# EAGLE design mmimplant (EAGLE 9.6.2)
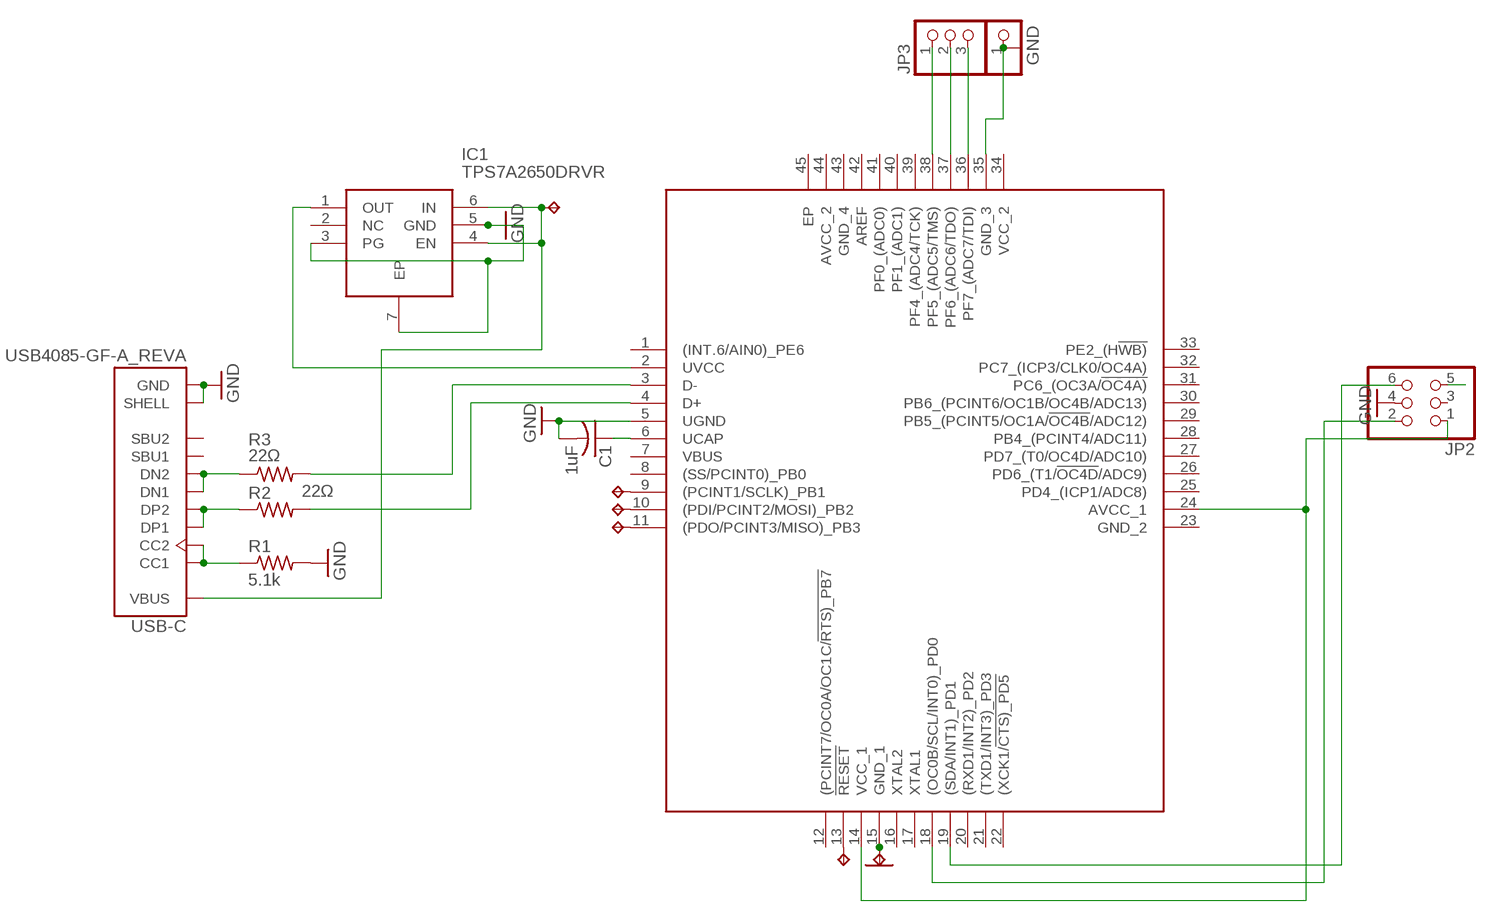
[diagram p0: schematic, sheet 1]

## Parts
5V  TPTP17R  [TP17R]
C1  1uF  C-USC0805  [C0805]
GND  TPTP17R  [TP17R]
IC1  TPS7A2650DRVR  [SON65P200X200X80-7N]
IC2  ATMEGA32U4-MU  [QFN50P700X700X100-45N]
JP1  PINHD-1X1  [1X01]
JP2  PINHD-2X3  [2X03]
JP3  PINHD-1X3  [1X03]
MISO  TPTP17R  [TP17R]
MOSI  TPTP17R  [TP17R]
R1  5.1k  R-US_R0603  [R0603]
R2  22Ω  R-US_R0805  [R0805]
R3  22Ω  R-US_R0805  [R0805]
RST  TPTP17R  [TP17R]
SCLK  TPTP17R  [TP17R]
USB-C  USB4085-GF-A_REVA  [GCT_USB4085-GF-A_REVA]

## Nets
5V: IC1.1(OUT) IC2.2(UVCC)
CAPS: IC2.38(PF5_(ADC5/TMS)) JP3.1
CC: R1.1 USB-C.A5(CC1) USB-C.B5(CC2)
CLK: IC2.19((SDA/INT1)_PD1) JP2.6
D+: R2.1 USB-C.A6(DP1) USB-C.B6(DP2)
D+RES: IC2.4(D+) R2.2
D-: R3.1 USB-C.A7(DN1) USB-C.B7(DN2)
D-RES: IC2.3(D-) R3.2
DATA: IC2.18((OC0B/SCL/INT0)_PD0) JP2.2
GND: C1.2 GND.TP IC1.3(PG) IC1.5(GND) IC1.7(EP) IC2.5(UGND) IC2.15(GND_1) IC2.35(GND_3) JP1.1 JP2.4 R1.2 USB-C.A1(GND) USB-C.A12(GND) USB-C.B1(GND) USB-C.B12(GND) USB-C.P1(SHELL) USB-C.P2(SHELL) USB-C.P3(SHELL) USB-C.P4(SHELL)
MISO: IC2.11((PDO/PCINT3/MISO)_PB3) MISO.TP
MOSI: IC2.10((PDI/PCINT2/MOSI)_PB2) MOSI.TP
NUM: IC2.37(PF6_(ADC6/TDO)) JP3.2
PE: JP2.5
RST: IC2.13(!RESET) RST.TP
SCLK: IC2.9((PCINT1/SCLK)_PB1) SCLK.TP
SCROLL: IC2.36(PF7_(ADC7/TDI)) JP3.3
UCAP: C1.1 IC2.6(UCAP)
VCC1: IC2.14(VCC_1) IC2.24(AVCC_1) JP2.1
VIN: 5V.TP IC1.4(EN) IC1.6(IN) USB-C.A4(VBUS) USB-C.A9(VBUS) USB-C.B4(VBUS) USB-C.B9(VBUS)
Unconnected: IC1.2(NC) IC2.1((INT.6/AIN0)_PE6) IC2.7(VBUS) IC2.8((SS/PCINT0)_PB0) IC2.12((PCINT7/OC0A/OC1C/!RTS)_PB7) IC2.16(XTAL2) IC2.17(XTAL1) IC2.20((RXD1/INT2)_PD2) IC2.21((TXD1/INT3)_PD3) IC2.22((XCK1/!CTS)_PD5) IC2.23(GND_2) IC2.25(PD4_(ICP1/ADC8)) IC2.26(PD6_(T1/!OC4D!/ADC9)) IC2.27(PD7_(T0/OC4D/ADC10)) IC2.28(PB4_(PCINT4/ADC11)) IC2.29(PB5_(PCINT5/OC1A/!OC4B!/ADC12)) IC2.30(PB6_(PCINT6/OC1B/OC4B/ADC13)) IC2.31(PC6_(OC3A/!OC4A)) IC2.32(PC7_(ICP3/CLK0/OC4A)) IC2.33(PE2_(H!WB)) IC2.34(VCC_2) IC2.39(PF4_(ADC4/TCK)) IC2.40(PF1_(ADC1)) IC2.41(PF0_(ADC0)) IC2.42(AREF) IC2.43(GND_4) IC2.44(AVCC_2) IC2.45(EP) JP2.3 USB-C.A8(SBU1) USB-C.B8(SBU2)

## Library data of the parts
5V GND MISO MOSI RST SCLK = testpad:TP: Test pad
C1 = adafruit:C-US: CAPACITOR, American symbol
IC1 = SamacSys_Parts:TPS7A2650DRVR: LDO Voltage Regulators 500-mA 18-V ultra-low-IQ low-dropout (LDO) linear voltage regulator with power good 6-WSON -40 to 125 Source: Datasheet <https://www.ti.com/lit/gpn/TPS7A26>; DESCRIPTION: LDO Voltage Regulators 500-mA 18-V ultra-low-IQ low-dropout (LDO) linear voltage regulator with power good 6-WSON -40 to 125; HEIGHT: 0.8mm; MANUFACTURER_NAME: Texas Instruments; MANUFACTURER_PART_NUMBER: TPS7A2650DRVR; MOUSER_PART_NUMBER: 595-TPS7A2650DRVR; MOUSER_PRICE-STOCK: https://www.mouser.co.uk/ProductDetail/Texas-Instruments/TPS7A2650DRVR?qs=OTrKUuiFdkaeaXj%2F%252BB59oA%3D%3D
IC2 = SamacSys_Parts:ATMEGA32U4-MU: MCU 8-bit ATmega AVR RISC 32KB Flash Atmel ATMEGA32U4-MU, 8bit AVR Microcontroller, 16MHz, 32 kB Flash, 44-Pin QFN Source: Datasheet <https://componentsearchengine.com/Datasheets/2/ATMEGA32U4-MU.pdf>; DESCRIPTION: MCU 8-bit ATmega AVR RISC 32KB Flash Atmel ATMEGA32U4-MU, 8bit AVR Microcontroller, 16MHz, 32 kB Flash, 44-Pin QFN; HEIGHT: 1mm; MANUFACTURER_NAME: Microchip; MANUFACTURER_PART_NUMBER: ATMEGA32U4-MU; MOUSER_PART_NUMBER: 556-ATMEGA32U4-MU; MOUSER_PRICE-STOCK: https://www.mouser.co.uk/ProductDetail/Microchip-Technology-Atmel/ATMEGA32U4-MU?qs=JV7lzlMm3yJYRpi0cY3cKw%3D%3D
JP1 = pinhead:PINHD-1X1: PIN HEADER
JP2 = pinhead:PINHD-2X3: PIN HEADER
JP3 = adafruit:PINHD-1X3: PIN HEADER
R1-R3 = adafruit:R-US_: RESISTOR, American symbol
USB-C = USB4085-GF-A_REVA:USB4085-GF-A_REVA: USB 2.0 Type C Receptacle Dip Type, PCB Top Mount Check prices <https://pricing.snapeda.com/parts/USB4085-GF-A/Global%20Connector%20Technology/view-part?ref=eda>; AVAILABILITY: Warning; DESCRIPTION: USB-C (USB TYPE-C) USB 2.0 Receptacle Connector 24 (16+8 Dummy) Position Through Hole, Right Angle; MF: Global Connector Technology; MP: USB4085-GF-A; PACKAGE: Package; PRICE: None; PURCHASE-URL: https://pricing.snapeda.com/search/part/USB4085-GF-A/?ref=eda

## Board
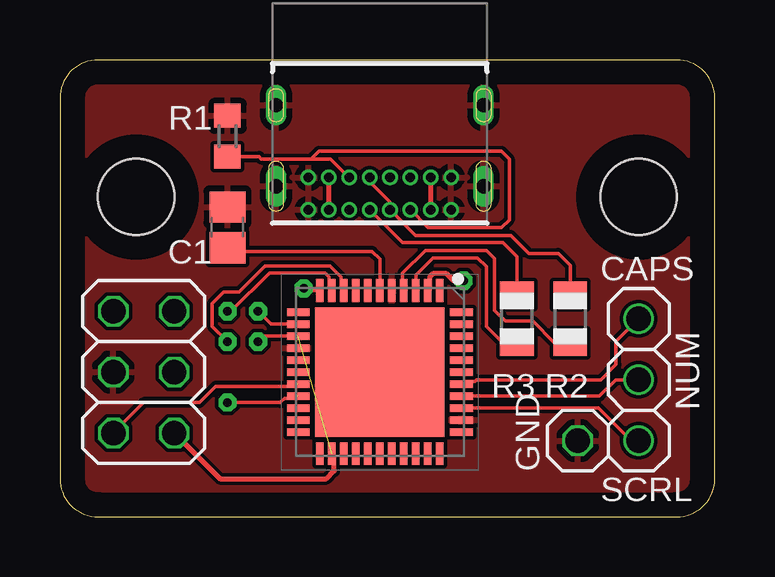
[diagram p1: board, top side]
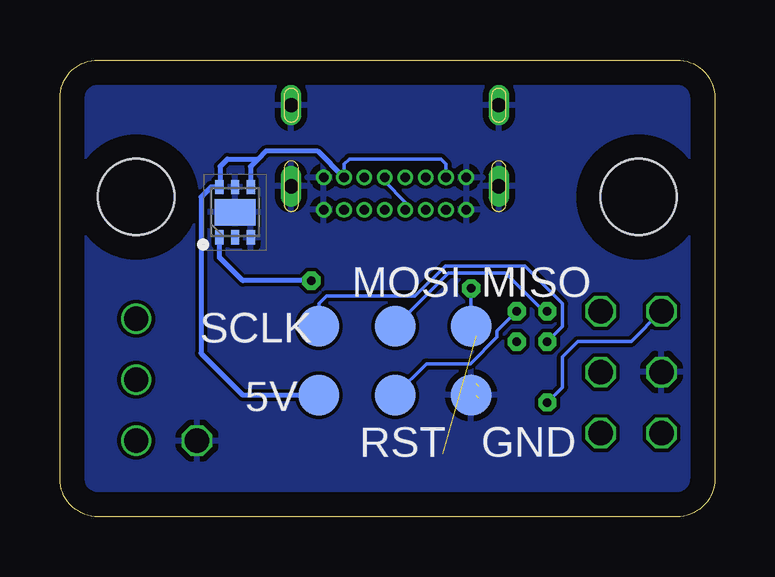
[diagram p2: board, bottom side, seen from below]

Size 27.3 x 19.05 mm. Coordinates in mm from the lower left corner, seen from the top.
Outline: 0,17.46 0,1.59 arc90 1.59,0 25.72,0 arc90 27.3,1.59 27.3,17.46 arc90 25.72,19.05 1.59,19.05 arc90 0,17.46
Copper layers (1*16): Top 0.035mm / dielectric 1.5mm / Bottom 0.035mm
Design rules "default *": minimum track width 6mil, minimum drill 0.35mm, track to track 6mil, track to pad 6mil, pad to pad 6mil, via to via 6mil, smd to smd 6mil, copper to edge 40mil, drill to drill 6mil, minimum pad ring 10mil, minimum via ring 8mil, stop-mask expansion 4mil, vias tented up to drill 0mil, thermal gap 10mil
Holes 3.17 mm at 3.17,13.34 24.13,13.34

### Footprints (pad centres in the part's own frame; a part is rotated, then mirrored left to right if it is on the bottom)
TP17R = smd 1.7 x 1.7: TP 0,0
C0805 = smd 1.3 x 1.5: 1 -0.85,0; 2 0.85,0
SON65P200X200X80-7N = smd 0.6 x 0.35: 1 -1.05,0.65; 2 -1.05,0; 3 -1.05,-0.65; 4 1.05,-0.65; 5 1.05,0; 6 1.05,0.65 | smd 1.1 x 1.7: 7 0,0
QFN50P700X700X100-45N = smd 0.95 x 0.3: 1 -3.4,2.5; 2 -3.4,2; 3 -3.4,1.5; 4 -3.4,1; 5 -3.4,0.5; 6 -3.4,0; 7 -3.4,-0.5; 8 -3.4,-1; 9 -3.4,-1.5; 10 -3.4,-2; 11 -3.4,-2.5; 23 3.4,-2.5; 24 3.4,-2; 25 3.4,-1.5; 26 3.4,-1; 27 3.4,-0.5; 28 3.4,0; 29 3.4,0.5; 30 3.4,1; 31 3.4,1.5; 32 3.4,2; 33 3.4,2.5 | smd 0.3 x 0.95: 12 -2.5,-3.4; 13 -2,-3.4; 14 -1.5,-3.4; 15 -1,-3.4; 16 -0.5,-3.4; 17 0,-3.4; 18 0.5,-3.4; 19 1,-3.4; 20 1.5,-3.4; 21 2,-3.4; 22 2.5,-3.4; 34 2.5,3.4; 35 2,3.4; 36 1.5,3.4; 37 1,3.4; 38 0.5,3.4; 39 0,3.4; 40 -0.5,3.4; 41 -1,3.4; 42 -1.5,3.4; 43 -2,3.4; 44 -2.5,3.4 | smd 5.4 x 5.4: 45 0,0
1X01 = drill 1.016 octagon: 1 0,0
2X03 = drill 1.016 octagon: 1 -2.54,-1.27; 2 -2.54,1.27; 3 0,-1.27; 4 0,1.27; 5 2.54,-1.27; 6 2.54,1.27
1X03 = drill 1.016: 1 -2.54,0; 2 0,0; 3 2.54,0
R0603 = smd 1 x 1.1: 1 -0.85,0; 2 0.85,0
R0805 = smd 1.1 x 1.4: 1 -1,0; 2 1,0
GCT_USB4085-GF-A_REVA = drill 0.4 pad 0.65: A1 -2.975,4.025; A4 -2.125,4.025; A5 -1.275,4.025; A6 -0.425,4.025; A7 0.425,4.025; A8 1.275,4.025; A9 2.125,4.025; A12 2.975,4.025; B1 2.975,2.675; B4 2.125,2.675; B5 1.275,2.675; B6 0.425,2.675; B7 -0.425,2.675; B8 -1.275,2.675; B9 -2.125,2.675; B12 -2.975,2.675 | drill 0.6 long: P1 -4.325,3.045; P2 4.325,3.045; P3 4.325,-0.335; P4 -4.325,-0.335

### Placement (x,y rotation side)
5V  16.51,5.08 0 bottom
C1  6.99,12.06 90 top
GND  10.16,5.08 0 bottom
IC1  20,12.7 90 bottom
IC2  13.34,6.03 270 top
JP1  21.59,3.17 0 top
JP2  3.49,6.03 90 top
JP3  24.13,5.71 270 top
MISO  10.16,7.94 270 bottom
MOSI  13.34,7.94 270 bottom
R1  6.99,15.88 90 top
R2  21.27,8.26 270 top
R3  19.05,8.26 270 top
RST  13.34,5.08 0 bottom
SCLK  16.51,7.94 270 bottom
USB-C  13.34,16.83 180 top

### Tracks (layer width: path | path; a pad name or v marks a point on that pad's centre or on a via)
5V  (via drill 0.35)
  Top 0.203: IC2.2 15.43,9.53 15.43,10.01 15.58,10.16 16.09,10.16 16.41,9.84 v16.83,9.84
  Bottom 0.203: v16.83,9.84 19.68,9.84 20.65,10.81 IC1.1
CAPS
  Top 0.152: IC2.38 16.86,5.65 17.3,5.65 17.37,5.71 22.54,5.71 23.18,6.35 23.18,7.3 JP3.1
CC
  Top 0.152: USB-C.B5 11.29,14.92 10.48,14.92 | R1.1 8.31,15.03 8.38,14.92 10.48,14.92 | USB-C.A5 15.35,12.06 18.41,12.06 18.73,12.38 18.73,14.92 18.41,15.24 10.79,15.24 10.48,14.92
CLK  (via drill 0.35)  (1 unrouted)
  Top 0.152: 9.84,4.94 9.36,4.94 9.18,4.76 v6.99,4.76
  Bottom 0.152: v6.99,4.76 6.35,5.4 6.35,6.67 5.71,7.3 3.49,7.3 JP2.6
D+
  Top 0.152: USB-C.B6 12.91,13.97 13.76,13.12 USB-C.A6 14.83,11.73 18.79,11.73 19.55,10.98 20.77,10.98 21.27,10.48 R2.1
D+RES
  Top 0.152: R2.2 20.62,7.25 19.72,8.16 18.57,8.16 18.12,8.61 18.12,10.77 17.78,11.11 15.24,11.11 14.29,10.16 14.29,9.48 IC2.4
D-
  Top 0.152: USB-C.A7 14.28,11.43 18.46,11.43 19.05,10.84 R3.1
  Bottom 0.152: USB-C.B7 13.76,13.97 12.91,13.12 USB-C.A7
D-RES
  Top 0.152: IC2.3 14.84,10.07 15.56,10.79 17.41,10.79 17.78,10.43 17.78,7.94 18.46,7.25 R3.2
DATA  (1 unrouted)
  Top 0.152: 9.84,5.44 6.49,5.44 5.82,4.76 3.49,4.76 JP2.2
GND
  pour Top: 0,19.05 0,0 27.3,0 27.3,19.05
  pour Bottom: 0,19.05 0,0 27.3,0 27.3,19.05
MISO  (via drill 0.35)
  Top 0.152: IC2.11 10.25,9.43 v10.16,9.53
  Bottom 0.152: v10.16,9.53 MISO.TP
MOSI  (via drill 0.35)
  Top 0.152: IC2.10 11.21,9.55 11.21,10 11.06,10.16 8.73,10.16 7.14,8.57 v6.99,8.57
  Bottom 0.152: v6.99,8.57 7.14,8.57 8.73,10.16 11.11,10.16 MOSI.TP
NUM
  Top 0.152: JP3.2 23.18,5.71 22.5,5.03 IC2.37
RST  (via drill 0.35)
  Top 0.152: IC2.13 8.79,8.03 v8.26,8.57
  Bottom 0.152: v8.26,8.57 9.08,7.75 9.08,7.49 10.19,6.38 12.03,6.38 RST.TP
SCLK  (via drill 0.35)
  Top 0.152: IC2.9 11.71,9.55 11.71,10 11.25,10.46 8.56,10.46 7.46,9.37 6.83,9.37 6.35,8.89 6.35,7.94 v6.99,7.3
  Bottom 0.152: v6.99,7.3 6.35,7.94 6.35,8.89 7.92,10.46 11.24,10.46 12.5,9.21 16.19,9.21 16.51,8.89 SCLK.TP
SCROLL
  Top 0.152: JP3.3 23.81,3.17 22.45,4.53 IC2.36
UCAP
  Top 0.152: IC2.6 13.34,10.74 13.02,11.06 6.99,11.06 C1.1
VCC1  (via drill 0.35)  (1 unrouted)
  Top 0.152: IC2.14 8.48,7.53 v8.26,7.3
  Top 0.203: JP2.1 6.67,1.59 11.11,1.59 11.43,1.91 11.43,2.54 IC2.24
VIN
  Top 0.203: USB-C.A9 USB-C.B4 | USB-C.A4 USB-C.B9
  Bottom 0.152: USB-C.B4 11.21,14.7 11.43,14.92 15.24,14.92 15.46,14.7 USB-C.B9
  Bottom 0.203: USB-C.B9 16.55,15.24 18.73,15.24 19.05,14.92 | 19.05,14.92 19.37,14.61 19.37,13.77 IC1.4 | 19.05,14.92 20.32,14.92 20.64,14.61 20.64,13.77 IC1.6 21.01,13.75 21.43,13.34 21.43,6.82 19.68,5.08 17.46,5.08 16.83,5.08 5V.TP

### Text on the board
tNames: CAPS | NUM | GND | SCRL